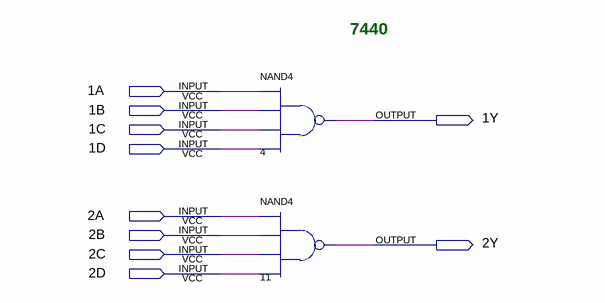
[diagram p0: schematic sheet]
// Quartus schematic 7440.bdf as structural Verilog: 2 symbols, 10 pins
module \7440  (
  input  \1A ,
  input  \1B ,
  input  \1C ,
  input  \1D ,
  input  \2A ,
  input  \2B ,
  input  \2C ,
  input  \2D ,
  output \1Y ,
  output \2Y 
);

  nand u_4 (\1Y , \1A , \1B , \1C , \1D );
  nand u_11 (\2Y , \2A , \2B , \2C , \2D );

  // Notes on the sheet:
  //   7440
endmodule
